# Altium schematic sheet dw1000.SchDoc
size A
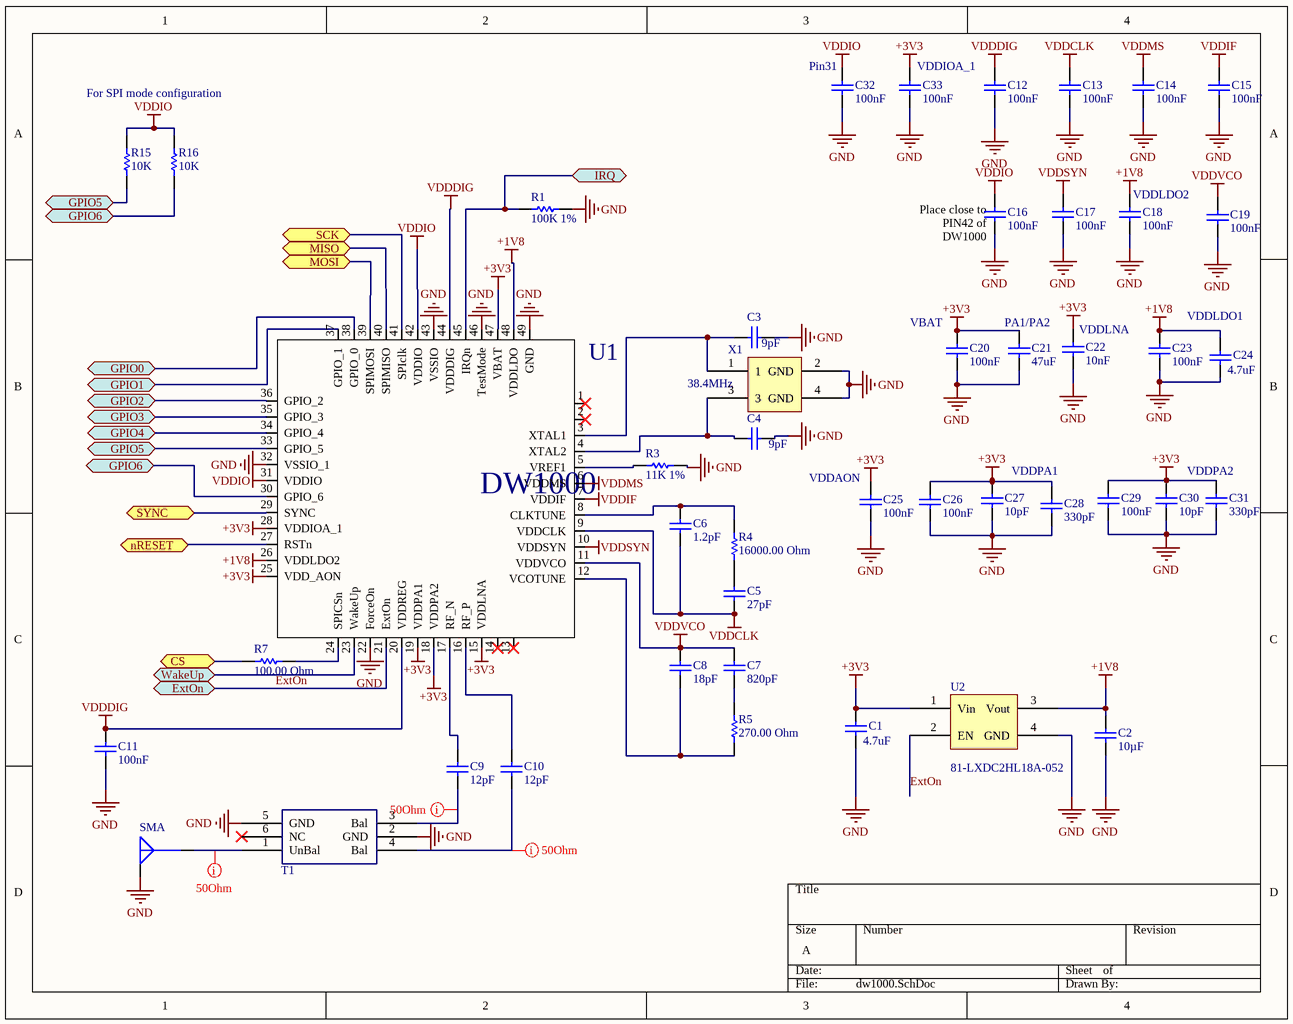
[diagram p0: dw1000.SchDoc]

## Parts
C1  4.7uF  [CAPC0603(1608)100_M]
C2  10µF  [CAPC1608X100X35ML20T25]
C3  9pF  [CAPC0402(1005)60_L]
C4  9pF  [CAPC0402(1005)60_L]
C5  27pF  [CAPC0402(1005)60_L]
C6  1.2pF  [CAPC0402(1005)60_L]
C7  820pF  [CAPC0402(1005)60_L]
C8  18pF  [CAPC0402(1005)60_L]
C9  12pF  [CAPC0402(1005)60_L]
C10  12pF  [CAPC0402(1005)60_L]
C11  100nF  [CAPC0402(1005)60_L]
C12  100nF  [CAPC0402(1005)60_L]
C13  100nF  [CAPC0402(1005)60_L]
C14  100nF  [CAPC0402(1005)60_L]
C15  100nF  [CAPC0402(1005)60_L]
C16  100nF  [CAPC0402(1005)60_L]
C17  100nF  [CAPC0402(1005)60_L]
C18  100nF  [CAPC0402(1005)60_L]
C19  100nF  [CAPC0402(1005)60_L]
C20  100nF  [CAPC0402(1005)60_L]
C21  47uF  [CAPC0805(2012)145_L]
C22  10nF  [CAPC0402(1005)60_L]
C23  100nF  [CAPC0402(1005)60_L]
C24  4.7uF  [CAPC0603(1608)100_M]
C25  100nF  [CAPC0402(1005)60_L]
C26  100nF  [CAPC0402(1005)60_L]
C27  10pF  [CAPC0402(1005)60_L]
C28  330pF  [CAPC0402(1005)60_L]
C29  100nF  [CAPC0402(1005)60_L]
C30  10pF  [CAPC0402(1005)60_L]
C31  330pF  [CAPC0402(1005)60_L]
C32  100nF  [CAPC0402(1005)60_L]
C33  100nF  [CAPC0402(1005)60_L]
R1  100K 1%  [RESC0402(1005)_M]
R3  11K 1%  [RESC0402(1005)_L]
R4  16000.00 Ohm  [RESC0402(1005)_L]
R5  270.00 Ohm  [RESC0402(1005)_L]
R7  100.00 Ohm  [RESC0402(1005)_L]
R15  10K  [RESC0603(1608)_L]
R16  10K  [RESC0603(1608)_L]
SMA  0732511150  [sma_footprint]  (value not drawn)
T1  HHM1595A1  [HHM1595A1]  (value not drawn)
U1  DW1000 IC  [QFN-48]  (value not drawn)
U2  81-LXDC2HL18A-052  [PCBComponent_1]
X1  38.4MHz  [tsx_3225fp]

## Ports
CS (bidir), ExtOn (bidir), GPIO0 (bidir), GPIO1 (bidir), GPIO2 (bidir), GPIO3 (bidir), GPIO4 (bidir), GPIO5 (bidir), GPIO6 (bidir), IRQ (bidir), MISO (bidir), MOSI (bidir), nRESET (bidir), SCK (bidir), SYNC (bidir), WakeUp (bidir)

## Nets
+1V8: C2.1 C18.1 C23.1 C24.2 U1.26(VDDLDO2) U1.48(VDDLDO) U2.3(Vout)
+3V3: C1.2 C20.1 C21.2 C22.1 C25.1 C26.1 C27.2 C28.1 C29.1 C30.2 C31.1 C33.1 U1.15(VDDLNA) U1.18(VDDPA2) U1.19(VDDPA1) U1.25(VDD_AON) U1.28(VDDIOA_1) U1.47(VBAT) U2.1(Vin)
GND: C1.1 C2.2 C3.2 C4.2 C11.2 C12.2 C13.2 C14.2 C15.2 C16.2 C17.2 C18.2 C19.2 C20.2 C21.1 C22.2 C23.2 C24.1 C25.2 C26.2 C27.1 C28.2 C29.2 C30.1 C31.2 C32.2 C33.2 R1.2 R3.2 SMA.G T1.2(GND) T1.5(GND) U1.22(ForceOn) U1.32(VSSIO_1) U1.43(VSSIO) U1.46(TestMode) U1.49(GND) U2.4(GND) X1.2(GND) X1.4(GND)
VDDCLK: C5.2 C6.2 C13.1 U1.9(VDDCLK)
VDDDIG: C11.1 C12.1 U1.20(VDDREG) U1.44(VDDDIG)
VDDIF: C15.1 U1.7(VDDIF)
VDDIO: C16.1 C32.1 R15.2 R16.2 U1.31(VDDIO) U1.42(VDDIO)
VDDMS: C14.1 U1.6(VDDMS)
VDDSYN: C17.1 U1.10(VDDSYN)
VDDVCO: C7.1 C8.2 C19.1 U1.11(VDDVCO)
CS: R7.2 ; port CS
ExtOn: U1.21(ExtOn) U2.2(EN) ; port ExtOn
GPIO0: U1.38(GPIO_0) ; port GPIO0
GPIO1: U1.37(GPIO_1) ; port GPIO1
GPIO2: U1.36(GPIO_2) ; port GPIO2
GPIO3: U1.35(GPIO_3) ; port GPIO3
GPIO4: U1.34(GPIO_4) ; port GPIO4
GPIO5: R15.1 U1.33(GPIO_5) ; port GPIO5
GPIO6: R16.1 U1.30(GPIO_6) ; port GPIO6
IRQ: R1.1 U1.45(IRQn) ; port IRQ
MISO: U1.40(SPIMISO) ; port MISO
MOSI: U1.39(SPIMOSI) ; port MOSI
nRESET: U1.27(RSTn) ; port nRESET
SCK: U1.41(SPIclk) ; port SCK
SYNC: U1.29(SYNC) ; port SYNC
WakeUp: U1.23(WakeUp) ; port WakeUp
NetC3_1: C3.1 U1.3(XTAL1) X1.1
NetC4_1: C4.1 U1.4(XTAL2) X1.3
NetC5_1: C5.1 R4.2
NetC6_1: C6.1 R4.1 U1.8(CLKTUNE)
NetC7_2: C7.2 R5.1
NetC8_1: C8.1 R5.2 U1.12(VCOTUNE)
NetC9_1: C9.1 U1.17(RF_N)
NetC9_2: C9.2 T1.3(Bal)
NetC10_1: C10.1 U1.16(RF_P)
NetC10_2: C10.2 T1.4(Bal)
NetR3_1: R3.1 U1.5(VREF1)
NetR7_1: R7.1 U1.24(SPICSn)
NetSMA_S: SMA.S T1.1(UnBal)

Not connected (* = marked no-connect by the designer): T1 6(NC)*; U1 1* 2* 13* 14*

## Layout directives
rule Impedance Constraint [Min = 50.00    Max = 50.00    ]: NetC9_2, NetC10_2, NetSMA_S

## Notes on the sheet
- For SPI mode configuration
- (near C32) Pin31
- (near C33) VDDIOA_1
- (near C18) VDDLDO2
- (near C16) Place close to PIN42 of DW1000
- (near C20) VBAT
- (near C21) PA1/PA2
- (near C22) VDDLNA
- VDDLDO1
- (near C25) VDDAON
- VDDPA1
- VDDPA2
- (in symbol DW1000_QFN_48) DW1000

## Library data of the parts
C1 C24 = CMP-1035-02780-1: CAP 4.7uF 6.3V ±10% 0603 (1608 Metric) Thickness 1mm SMD; Case-Metric: 1608; Case-EIA: 0603; Tolerance: Â±10%; Technology: SMT; Value: 4.7uF; Max Thickness: 1 mm; Rated Voltage: 6.3 V
C2 = CMP-2000-05443-1: High Value Multilayer Ceramic Capacitor, 10 uF, +/- 20%, 10 V, -55 to 85 degC, 0603 (1608 Metric), RoHS, Tape and Reel; Manufacturer: Taiyo Yuden; Voltage - Rated: 10V; Catalog Drawings: xMKSeries_0603_0.8; Temperature Coefficient: X5R; Other Names: 587-2562-6; Featured Product: MultilayerChipCapacitors; Online Catalog: MSeries; Standard Package: 1; Capacitance: 10µF; Thickness (Max): 0.035"(0.90mm); Applications: GeneralPurpose; Manufacturer URL: http://www.t-yuden.com/; Datasheet Version: Apr-14; Mounting Type: SurfaceMount,MLCC; Height - Seated (Max): -; Tolerance: ±20%; Package Reference: 603; Ratings: -; Category: Capacitors; Lead Spacing: -; Package Description: 2-Pin Surface Mount Device, Body 1.70 x 0.90 mm; Packaging: Digi-Reel; Size / Dimension: 0.063"Lx0.031"W(1.60mmx0.80mm); Family: CeramicCapacitors; Datasheet URL: https://datasheet.ciiva.com/15921/288lmk107bbj106malt-15921300.pdf; Features: -; Series: M; Operating Temperature: -55degC~85degC; Lead Style: -; Package / Case: 0603(1608Metric)
C3 C4 = CMP-1034-00643-1: CAP 9pF 50V ±0.05pF 0402 (1005 Metric) Thickness 0.6mm SMD; Case-Metric: 1005; Case-EIA: 0402; Tolerance: Â±0.05pF; Technology: SMT; Max Thickness: 0.6 mm; Rated Voltage: 50 V; Value: 9pF
C5 = CMP-1034-00961-1: CAP 27pF 50V ±2% 0402 (1005 Metric) Thickness 0.6mm SMD; Tolerance: Â±2%; Case-EIA: 0402; Case-Metric: 1005; Value: 27pF; Technology: SMT; Rated Voltage: 50 V; Max Thickness: 0.6 mm
C6 = CMP-1034-00083-1: CAP 1.2pF 50V ±0.05pF 0402 (1005 Metric) Thickness 0.6mm SMD; Case-EIA: 0402; Tolerance: Â±0.05pF; Case-Metric: 1005; Value: 1.2pF; Rated Voltage: 50 V; Technology: SMT; Max Thickness: 0.6 mm
C7 = CMP-1034-01592-1: CAP 820pF 50V ±2% 0402 (1005 Metric) Thickness 0.6mm SMD; Case-Metric: 1005; Tolerance: Â±2%; Case-EIA: 0402; Value: 820pF; Max Thickness: 0.6 mm; Technology: SMT; Rated Voltage: 50 V
C8 = CMP-1034-00863-1: CAP 18pF 50V ±2% 0402 (1005 Metric) Thickness 0.6mm SMD; Case-Metric: 1005; Case-EIA: 0402; Tolerance: Â±2%; Technology: SMT; Max Thickness: 0.6 mm; Rated Voltage: 50 V; Value: 18pF
C9 C10 = CMP-1034-00768-1: CAP 12pF 50V ±2% 0402 (1005 Metric) Thickness 0.6mm SMD; Case-EIA: 0402; Case-Metric: 1005; Tolerance: Â±2%; Max Thickness: 0.6 mm; Technology: SMT; Rated Voltage: 50 V; Value: 12pF
C11-C20 C23 C25 C26 C29 C32 C33 = CMP-1034-02069-1: CAP 100nF 16V ±10% 0402 (1005 Metric) Thickness 0.6mm SMD; Case-EIA: 0402; Case-Metric: 1005; Tolerance: Â±10%; Value: 100nF; Max Thickness: 0.6 mm; Rated Voltage: 16 V; Technology: SMT
C21 = CMP-1036-04950-1: CAP 47uF 6.3V ±20% 0805 (2012 Metric) Thickness 1.45mm SMD; Case-EIA: 0805; Case-Metric: 2012; Tolerance: Â±20%; Technology: SMT; Value: 47uF; Max Thickness: 1.45 mm; Rated Voltage: 6.3 V
C22 = CMP-1034-01880-1: CAP 10nF 25V ±10% 0402 (1005 Metric) Thickness 0.6mm SMD; Tolerance: Â±10%; Case-Metric: 1005; Case-EIA: 0402; Technology: SMT; Value: 10nF; Max Thickness: 0.6 mm; Rated Voltage: 25 V
C27 C30 = CMP-1034-00722-1: CAP 10pF 50V ±2% 0402 (1005 Metric) Thickness 0.6mm SMD; Tolerance: Â±2%; Case-Metric: 1005; Case-EIA: 0402; Technology: SMT; Value: 10pF; Max Thickness: 0.6 mm; Rated Voltage: 50 V
C28 C31 = CMP-1034-01432-1: CAP 330pF 50V ±2% 0402 (1005 Metric) Thickness 0.6mm SMD; Tolerance: Â±2%; Case-EIA: 0402; Case-Metric: 1005; Value: 330pF; Technology: SMT; Rated Voltage: 50 V; Max Thickness: 0.6 mm
R1 = CMP-1011-00736-1: 100K 0.063W 1% 0402 (1005 Metric)  SMD; Value: 100000.00 Ohm; Case-EIA: 0402; Case-Metric: 1005; Power: 0.063 W; Tolerance: 1 %; Technology: SMT
R3 = CMP-1011-00627-1: 11K 0.063W 1% 0402 (1005 Metric)  SMD; Case-EIA: 0402; Case-Metric: 1005; Value: 11000.00 Ohm; Technology: SMT; Tolerance: 1 %; Power: 0.063 W
R4 = CMP-1011-00644-1: 16K 0.063W 1% 0402 (1005 Metric)  SMD; Case-EIA: 0402; Case-Metric: 1005; Power: 0.063 W; Value: 16000.00 Ohm; Technology: SMT; Tolerance: 1 %
R5 = CMP-1011-00444-1: 270R 0.063W 1% 0402 (1005 Metric)  SMD; Case-EIA: 0402; Case-Metric: 1005; Technology: SMT; Value: 270.00 Ohm; Tolerance: 1 %; Power: 0.063 W
R7 = CMP-1011-00397-1: 100R 0.063W 1% 0402 (1005 Metric)  SMD; Case-EIA: 0402; Case-Metric: 1005; Technology: SMT; Tolerance: 1 %; Power: 0.063 W; Value: 100.00 Ohm
R15 R16 = CMP-1012-00098-1: 10K 0.1W 5% 0603 (1608 Metric)  SMD; Case-EIA: 0603; Value: 10000.00 Ohm; Case-Metric: 1608; Technology: SMT; Tolerance: 5 %; Power: 0.1 W
SMA = 0732511150: CONN SMA JACK 50 OHM EDGE MNT; Manufacturer: Molex, LLC; Contact Termination: Solder; Impedance: 50 Ohm; Frequency - Max: 18GHz; Body Material: Brass; Body Finish: Gold; Center Contact Material: Beryllium Copper; Dielectric Material: Polytetrafluoroethylene (PTFE); Voltage Rating: 500V; Part Number: 0732511150; PartId: 21185; Supplier 1: Digi-Key; Supplier Part Number 1: WM5534-ND; ComponentLink1Description: Datasheet; ComponentLink1URL: http://www.molex.com/pdm_docs/sd/732511150_sd.pdf; ComponentLink2Description: Digi-Key Listing; ComponentLink2URL: http://www.digikey.ca/product-detail/en/molex-llc/0732511150/WM5534-ND/1465156; Price: 4.81; Type: Receptacle, Female Socket; Operating Temperature: -65C ~ 165C; Style: SMA; Series: 73251; Shield Termination: Solder; Mounting Type: Board Edge, End Launch; Cable Group: -; Fastening Type: Threaded; Features: -; Housing Colour: Gold; Ingress Protection: -; Center Contact Plating: Gold
T1 = HHM1595A1: HHM1595A1 3000MHz - 8000MHz 0805; Category Letter: T; Category: Filter; Part Number: HHM1595A1
U1 = DW1000_QFN_48: UWB DW1000; Manufacturer: Decawave Ltd.; Part Number: DW1000_QFN; Component Code: n/a; Component Type: Standard; Cost: *; Footprint: QFN_48; ComponentLink1Description: Datasheet Link
U2 X1 = Component_1
  U2: Supplier 1: Mouser; Supplier Part Number 1: 81-LXDC2HL18A-052